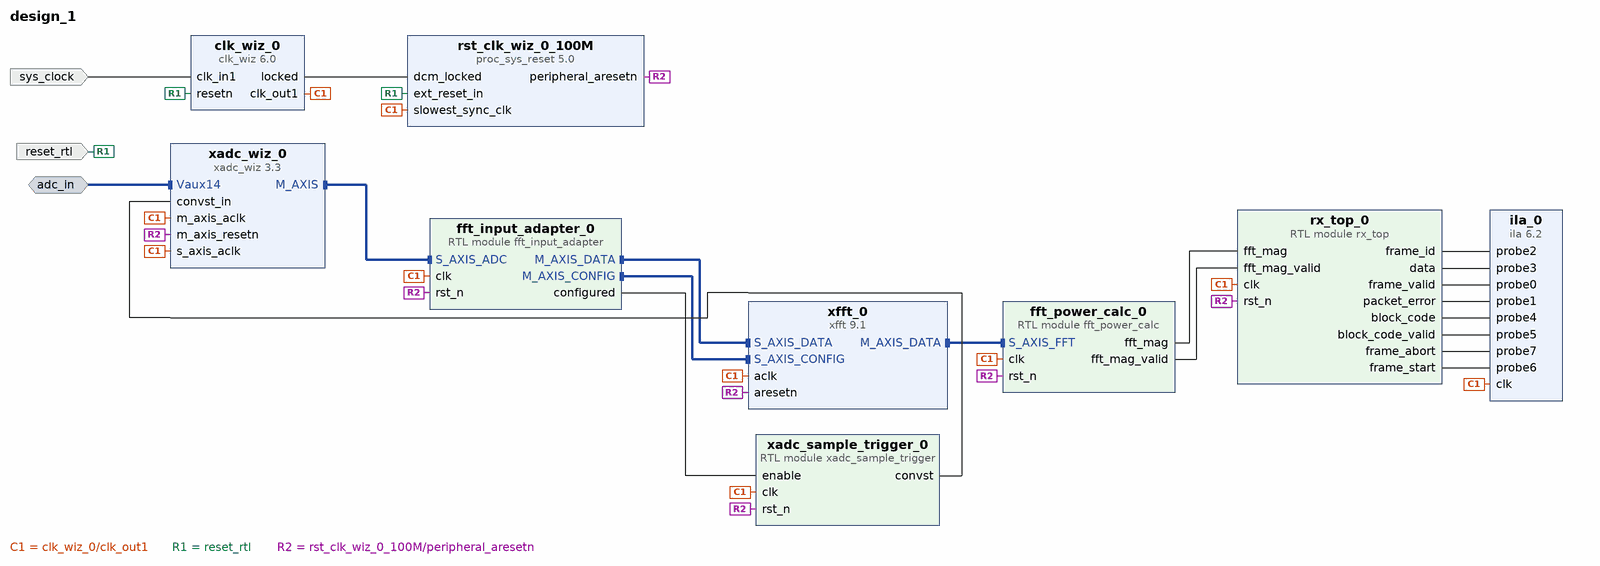
[diagram p0: block diagram of the top level]
# Vivado block design design_1, xc7z020clg400-1, Vivado 2020.2
create_bd_design design_1

create_bd_intf_port -mode Slave -vlnv xilinx.com:interface:diff_analog_io_rtl:1.0 adc_in
create_bd_port -dir I -type clk sys_clock
set_property -dict {CONFIG.FREQ_HZ 125000000 CONFIG.PHASE 0.000} [get_bd_ports sys_clock]
create_bd_port -dir I -type rst reset_rtl
set_property -dict {CONFIG.POLARITY ACTIVE_LOW} [get_bd_ports reset_rtl]

create_bd_cell -type module -reference rx_top rx_top_0
create_bd_cell -type ip -vlnv xilinx.com:ip:clk_wiz:6.0 clk_wiz_0
set_property -dict [list \
  CONFIG.CLKIN1_JITTER_PS 80.0 \
  CONFIG.CLKOUT1_JITTER 124.615 \
  CONFIG.CLKOUT1_PHASE_ERROR 96.948 \
  CONFIG.CLK_IN1_BOARD_INTERFACE sys_clock \
  CONFIG.CLK_IN2_BOARD_INTERFACE Custom \
  CONFIG.MMCM_CLKFBOUT_MULT_F 8.000 \
  CONFIG.MMCM_CLKIN1_PERIOD 8.000 \
  CONFIG.PRIM_IN_FREQ 125.000 \
  CONFIG.RESET_BOARD_INTERFACE Custom \
  CONFIG.RESET_PORT resetn \
  CONFIG.RESET_TYPE ACTIVE_LOW \
  CONFIG.USE_BOARD_FLOW true \
  CONFIG.USE_RESET true \
] [get_bd_cells clk_wiz_0]
create_bd_cell -type ip -vlnv xilinx.com:ip:xfft:9.1 xfft_0
set_property -dict [list \
  CONFIG.aresetn true \
  CONFIG.cyclic_prefix_insertion false \
  CONFIG.implementation_options pipelined_streaming_io \
  CONFIG.input_width 12 \
  CONFIG.number_of_stages_using_block_ram_for_data_and_phase_factors 0 \
  CONFIG.output_ordering natural_order \
  CONFIG.ovflo true \
  CONFIG.phase_factor_width 16 \
  CONFIG.target_clock_frequency 100 \
  CONFIG.target_data_throughput 50 \
  CONFIG.transform_length 128 \
  CONFIG.xk_index true \
] [get_bd_cells xfft_0]
create_bd_cell -type module -reference fft_power_calc fft_power_calc_0
create_bd_cell -type ip -vlnv xilinx.com:ip:xadc_wiz:3.3 xadc_wiz_0
set_property -dict [list \
  CONFIG.CHANNEL_ENABLE_VAUXP14_VAUXN14 true \
  CONFIG.CHANNEL_ENABLE_VP_VN false \
  CONFIG.ENABLE_AXI4STREAM true \
  CONFIG.ENABLE_RESET true \
  CONFIG.FIFO_DEPTH 256 \
  CONFIG.INTERFACE_SELECTION None \
  CONFIG.SINGLE_CHANNEL_SELECTION VAUXP14_VAUXN14 \
  CONFIG.TIMING_MODE Event \
] [get_bd_cells xadc_wiz_0]
create_bd_cell -type module -reference fft_input_adapter fft_input_adapter_0
create_bd_cell -type ip -vlnv xilinx.com:ip:proc_sys_reset:5.0 rst_clk_wiz_0_100M
create_bd_cell -type module -reference xadc_sample_trigger xadc_sample_trigger_0
create_bd_cell -type ip -vlnv xilinx.com:ip:ila:6.2 ila_0
set_property -dict [list \
  CONFIG.ALL_PROBE_SAME_MU_CNT 2 \
  CONFIG.C_DATA_DEPTH 4096 \
  CONFIG.C_ENABLE_ILA_AXI_MON false \
  CONFIG.C_EN_STRG_QUAL 1 \
  CONFIG.C_MONITOR_TYPE Native \
  CONFIG.C_NUM_OF_PROBES 8 \
  CONFIG.C_PROBE0_MU_CNT 2 \
  CONFIG.C_PROBE1_MU_CNT 2 \
  CONFIG.C_PROBE2_MU_CNT 2 \
  CONFIG.C_PROBE3_MU_CNT 2 \
  CONFIG.C_PROBE4_MU_CNT 2 \
  CONFIG.C_PROBE5_MU_CNT 2 \
  CONFIG.C_PROBE6_MU_CNT 2 \
  CONFIG.C_PROBE7_MU_CNT 2 \
] [get_bd_cells ila_0]

# ---- connections ----

connect_bd_intf_net [get_bd_intf_pins fft_input_adapter_0/M_AXIS_DATA] [get_bd_intf_pins xfft_0/S_AXIS_DATA]
connect_bd_intf_net [get_bd_intf_pins xfft_0/M_AXIS_DATA] [get_bd_intf_pins fft_power_calc_0/S_AXIS_FFT]
connect_bd_intf_net -intf_net Vaux14_0_1 [get_bd_intf_ports adc_in] [get_bd_intf_pins xadc_wiz_0/Vaux14]
connect_bd_intf_net [get_bd_intf_pins xadc_wiz_0/M_AXIS] [get_bd_intf_pins fft_input_adapter_0/S_AXIS_ADC]
connect_bd_intf_net [get_bd_intf_pins fft_input_adapter_0/M_AXIS_CONFIG] [get_bd_intf_pins xfft_0/S_AXIS_CONFIG]
connect_bd_net [get_bd_ports sys_clock] [get_bd_pins clk_wiz_0/clk_in1]
connect_bd_net [get_bd_pins clk_wiz_0/clk_out1] \
  [get_bd_pins rx_top_0/clk] [get_bd_pins xfft_0/aclk] [get_bd_pins fft_power_calc_0/clk] \
  [get_bd_pins xadc_wiz_0/s_axis_aclk] [get_bd_pins fft_input_adapter_0/clk] [get_bd_pins xadc_wiz_0/m_axis_aclk] \
  [get_bd_pins rst_clk_wiz_0_100M/slowest_sync_clk] [get_bd_pins xadc_sample_trigger_0/clk] [get_bd_pins ila_0/clk]
connect_bd_net [get_bd_ports reset_rtl] [get_bd_pins clk_wiz_0/resetn] [get_bd_pins rst_clk_wiz_0_100M/ext_reset_in]
connect_bd_net [get_bd_pins clk_wiz_0/locked] [get_bd_pins rst_clk_wiz_0_100M/dcm_locked]
connect_bd_net [get_bd_pins fft_power_calc_0/fft_mag] [get_bd_pins rx_top_0/fft_mag]
connect_bd_net [get_bd_pins fft_power_calc_0/fft_mag_valid] [get_bd_pins rx_top_0/fft_mag_valid]
connect_bd_net [get_bd_pins rst_clk_wiz_0_100M/peripheral_aresetn] \
  [get_bd_pins fft_input_adapter_0/rst_n] [get_bd_pins xadc_wiz_0/m_axis_resetn] [get_bd_pins xadc_sample_trigger_0/rst_n] \
  [get_bd_pins xfft_0/aresetn] [get_bd_pins fft_power_calc_0/rst_n] [get_bd_pins rx_top_0/rst_n]
connect_bd_net [get_bd_pins fft_input_adapter_0/configured] [get_bd_pins xadc_sample_trigger_0/enable]
connect_bd_net [get_bd_pins xadc_sample_trigger_0/convst] [get_bd_pins xadc_wiz_0/convst_in]
connect_bd_net [get_bd_pins rx_top_0/frame_id] [get_bd_pins ila_0/probe2]
connect_bd_net [get_bd_pins rx_top_0/data] [get_bd_pins ila_0/probe3]
connect_bd_net [get_bd_pins rx_top_0/frame_valid] [get_bd_pins ila_0/probe0]
connect_bd_net [get_bd_pins rx_top_0/packet_error] [get_bd_pins ila_0/probe1]
connect_bd_net [get_bd_pins rx_top_0/block_code] [get_bd_pins ila_0/probe4]
connect_bd_net [get_bd_pins rx_top_0/block_code_valid] [get_bd_pins ila_0/probe5]
connect_bd_net [get_bd_pins rx_top_0/frame_abort] [get_bd_pins ila_0/probe7]
connect_bd_net [get_bd_pins rx_top_0/frame_start] [get_bd_pins ila_0/probe6]

validate_bd_design
save_bd_design
